# EAGLE design tort (EAGLE 6.4)
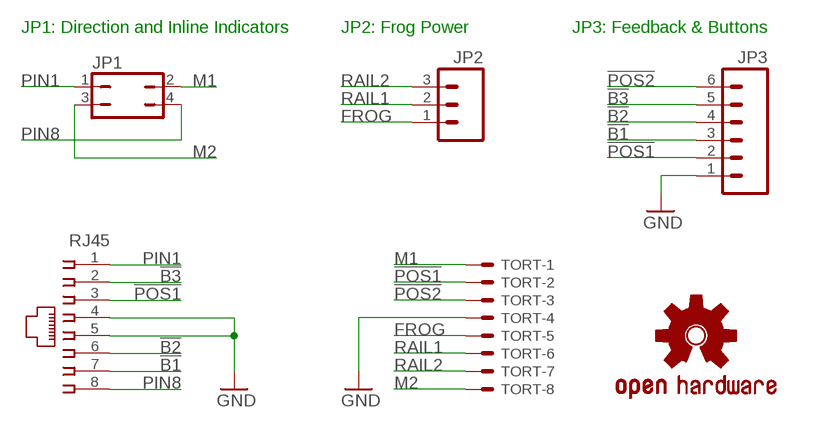
[diagram p0: schematic, sheet 1]

## Parts
JP1  JP2Q  [JP2Q]
JP2  M03-SCREW-5MM  [SCREWTERMINAL-5MM-3]
JP3  M063.5MM-6  [SCREWTERMINAL-3.5MM-6]
LOGO1  OSHW-LOGOL  [OSHW-LOGO-L]
RJ45  215877-7  [215877-7]
STANDOFF1  STAND-OFF  [STAND-OFF]
TORT  KK-156-8  [KK-156-8]

## Nets
!B1: JP3.3 RJ45.7
!B2: JP3.4 RJ45.6
!B3: JP3.5 RJ45.2
!POS1: JP3.2 RJ45.3 TORT.2
!POS2: JP3.6 TORT.3
FROG: JP2.1 TORT.5
GND: JP3.1 RJ45.4 RJ45.5 TORT.4
M1: JP1.2 TORT.1
M2: JP1.3 TORT.8
PIN1: JP1.1 RJ45.1
PIN8: JP1.4 RJ45.8
RAIL1: JP2.2 TORT.6
RAIL2: JP2.3 TORT.7

## Notes on the sheet
- JP1: Direction and Inline Indicators | JP2: Frog Power | JP3: Feedback & Buttons

## Library data of the parts
JP1 = jumper:JP2Q: JUMPER
JP2 = SparkFun-Connectors:M03: Header 3 Standard 3-pin 0.1" header. Use with straight break away headers (SKU : PRT-00116), right angle break away headers (PRT-00553), swiss pins (PRT-00743), machine pins (PRT-00117), and female headers (PRT-00115). Molex polarized connector foot print use with SKU : PRT-08232 with associated crimp pins and housings.
JP3 = SparkFun-Connectors:M06: Header 6 Standard 6-pin 0.1" header. Use with straight break away headers (SKU : PRT-00116), right angle break away headers (PRT-00553), swiss pins (PRT-00743), machine pins (PRT-00117), and female headers (PRT-00115). Molex polarized connector foot print use with SKU : PRT-08094 with associated crimp pins and housings. NOTES ON THE VARIANTS LOCK and LOCK_LONGPADS... This footprint was designed to help hold the alignment of a through-hole component (i.e. 6-pin header) while soldering it into place. You may notice that each hole has been shifted either up or down by 0.005 of an inch from it's more standard position (which is a perfectly straight line). This slight alteration caused the pins (the squares in the middle) to touch the edges of the holes. Because they are alternating, it causes a "brace" to hold the component in place. 0.005 has proven to be the perfect amount of "off-center" position when using our standard breakaway headers. Although looks a little odd when you look at the bare footprint, once you have a header in there, the alteration is very hard to notice. Also, if you push a header all the way into place, it is covered up entirely on the bottom side. This idea of altering the position of holes to aid alignment will be further integrated into the Sparkfun Library for other footprints. It can help hold any component with 3 or more connection pins.
LOGO1 = SparkFun-Aesthetics:OSHW-LOGO: Open Source Hardware Logo This logo indicates the piece of hardware it is found on incorporates a OSHW license and/or adheres to the definition of open source hardware found here: http://freedomdefined.org/OSHW
RJ45 = con-amp:215877-7: AMP connector
STANDOFF1 = SparkFun-Electromechanical:STAND-OFF: #4 Stand Off This is the mechanical footprint for a #4 phillips button head screw. Use the keepout ring to avoid running the screw head into surrounding components. SKU : PRT-00447
TORT = con-molex:KK-156-8: KK 156 HEADER Source: http://www.molex.com/pdm_docs/sd/026604100_sd.pdf; OC_FARNELL: unknown; OC_NEWARK: unknown

## Board
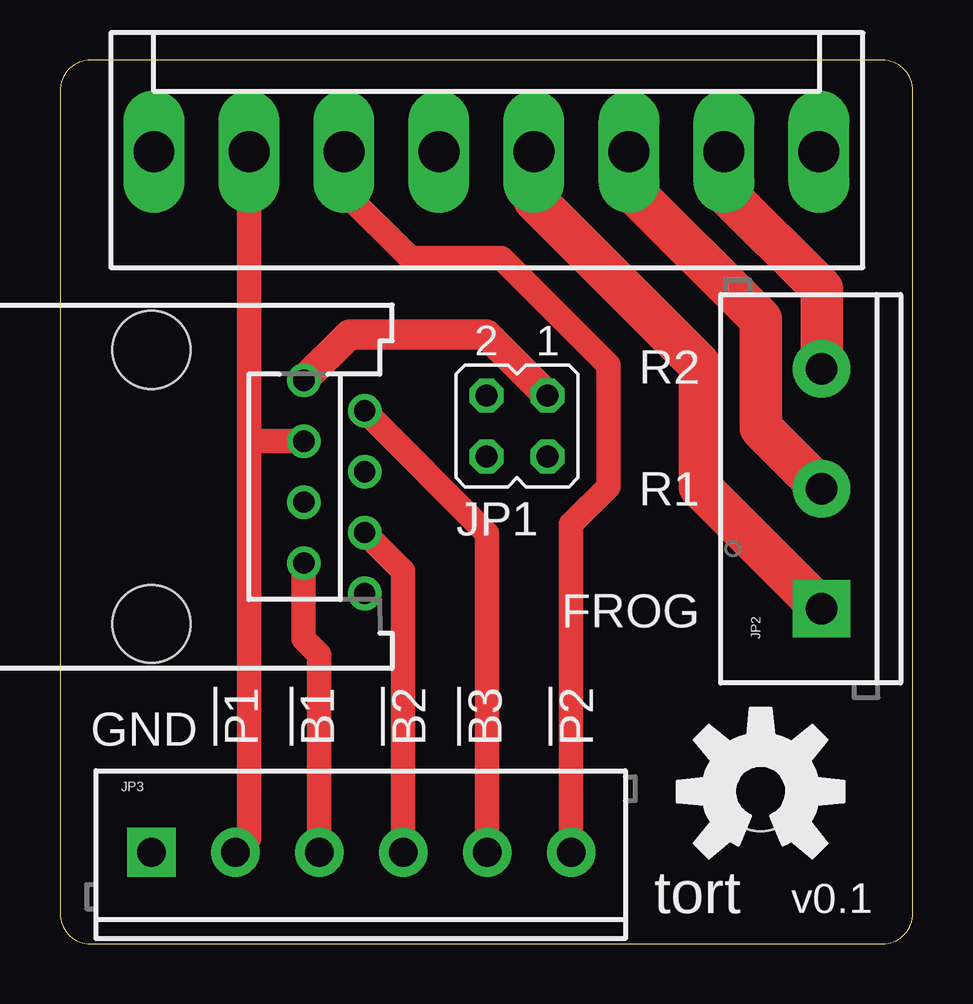
[diagram p1: board, top side]
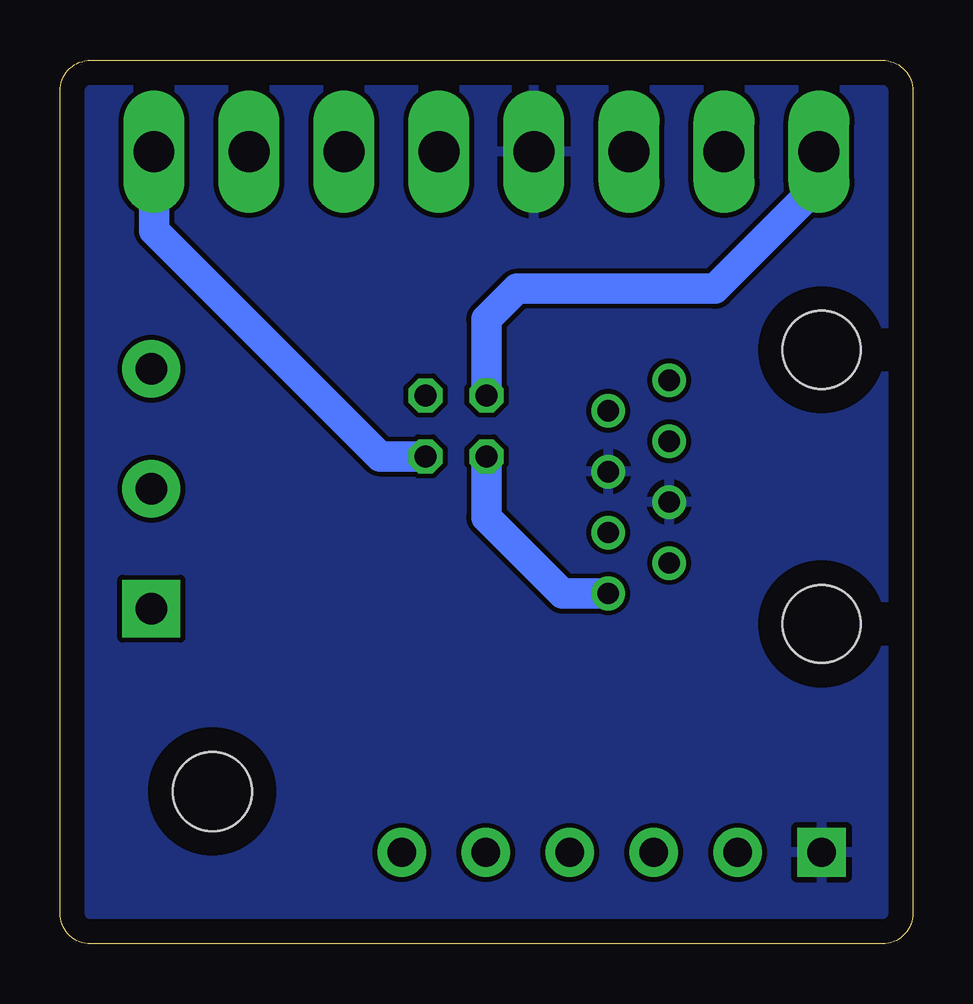
[diagram p2: board, bottom side, seen from below]

Size 35.56 x 36.83 mm. Coordinates in mm from the lower left corner, seen from the top.
Outline: 0,35.56 0,1.27 arc90 1.27,0 34.29,0 arc90 35.56,1.27 35.56,35.56 arc90 34.29,36.83 1.27,36.83 arc90 0,35.56
Copper layers (1*16): Top 0.035mm / dielectric 1.5mm / Bottom 0.035mm
Design rules "default": minimum track width 10mil, minimum drill 24mil, track to track 8mil, track to pad 8mil, pad to pad 8mil, via to via 8mil, smd to smd 8mil, copper to edge 40mil, drill to drill 8mil, minimum pad ring 10mil, minimum via ring 8mil, stop-mask expansion 4mil, vias tented up to drill 0mil, thermal gap 10mil

### Footprints (pad centres in the part's own frame; a part is rotated, then mirrored left to right if it is on the bottom)
JP2Q = drill 0.914 octagon: 1 -1.27,-1.27; 2 1.27,-1.27; 3 -1.27,1.27; 4 1.27,1.27
SCREWTERMINAL-5MM-3 = drill 1.3 pad 2.413 square: 1 0,0 | drill 1.3 pad 2.413: 2 5,0; 3 10,0
SCREWTERMINAL-3.5MM-6 = drill 1.2 pad 2.032 square: 1 0,0 | drill 1.2 pad 2.032: 2 3.5,0; 3 7,0; 4 10.5,0; 5 14,0; 6 17.5,0
215877-7 = drill 0.889: 1 -4.445,6.35; 2 -3.175,8.89; 3 -1.905,6.35; 4 -0.635,8.89; 5 0.635,6.35; 6 1.905,8.89; 7 3.175,6.35; 8 4.445,8.89 | hole 3.251: -5.715,0; 5.715,0
STAND-OFF = hole 3.302: 0,0
KK-156-8 = drill 1.7 pad 2.184 long: 1 -13.86,0; 2 -9.9,0; 3 -5.94,0; 4 -1.98,0; 5 1.98,0; 6 5.94,0; 7 9.9,0; 8 13.86,0

### Placement (x,y rotation side)
JP1  19.05,21.59 180 top
JP2  31.75,13.97 90 top
JP3  3.81,3.81 0 top
LOGO1  29.21,6.35 0 top
RJ45  3.81,19.05 270 top
STANDOFF1  29.21,6.35 0 top
TORT  17.78,33.02 0 top

### Tracks (layer width: path | path; a pad name or v marks a point on that pad's centre or on a via)
!B1
  Top 1.016: RJ45.7 10.16,12.7 10.79,12.06 JP3.3
!B2
  Top 1.016: JP3.4 14.31,15.54 RJ45.6
!B3
  Top 1.016: JP3.5 17.81,17.11 RJ45.2
!POS1
  Top 1.016: TORT.2 7.88,20.95 | 7.88,20.95 7.88,4.38 JP3.2 | RJ45.3 7.88,20.95
!POS2
  Top 1.016: TORT.3 11.84,31.34 14.61,28.57 18.41,28.57 22.86,24.13 22.86,19.05 21.31,17.5 JP3.6
FROG
  Top 1.778: TORT.5 19.76,31.04 26.67,24.13 26.67,19.05 JP2.1
GND
  pour Bottom: 0,0 0,36.83 35.56,36.83 35.56,0
M1
  Bottom 1.27: JP1.2 17.78,26.04 16.51,27.3 8.26,27.3 3.92,31.64 TORT.1
M2
  Bottom 1.27: TORT.8 31.64,29.73 22.23,20.32 JP1.3
PIN1
  Top 1.27: JP1.1 17.78,25.4 12.06,25.4 RJ45.1
PIN8
  Bottom 1.27: JP1.4 17.78,17.78 14.61,14.61 RJ45.8
RAIL1
  Top 1.778: TORT.6 23.72,31.52 29.21,26.04 29.21,21.51 JP2.2
RAIL2
  Top 1.778: TORT.7 27.68,31.38 31.75,27.3 JP2.3

### Text on the board
tPlace: R2 | R1 | FROG | GND | !P1 | !B1 | !B2 | !B3 | !P2 | tort | v0.1